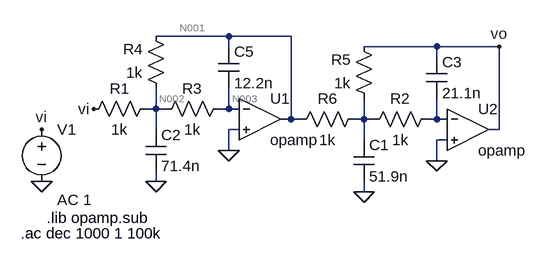
[diagram p0: schematic Draft1.asc]
Draft1.asc, the LTspice schematic file:
Version 4
SHEET 1 880 680
WIRE 80 0 -32 0
WIRE 176 0 80 0
WIRE 80 16 80 0
WIRE 400 16 288 16
WIRE 496 16 400 16
WIRE 400 32 400 16
WIRE -32 112 -32 80
WIRE -32 112 -48 112
WIRE -16 112 -32 112
WIRE 80 112 80 80
WIRE 80 112 64 112
WIRE 96 112 80 112
WIRE 176 128 176 0
WIRE 176 128 160 128
WIRE 192 128 176 128
WIRE 288 128 288 96
WIRE 288 128 272 128
WIRE 304 128 288 128
WIRE 400 128 400 96
WIRE 400 128 384 128
WIRE 416 128 400 128
WIRE -32 144 -32 112
WIRE 96 144 80 144
WIRE 496 144 496 16
WIRE 496 144 480 144
WIRE 288 160 288 128
WIRE 416 160 400 160
WIRE 80 176 80 144
WIRE 400 192 400 160
WIRE -32 224 -32 208
WIRE 288 240 288 224
FLAG -32 224 0
FLAG 80 176 0
FLAG -208 224 0
FLAG -208 144 vi
FLAG -128 112 vi
FLAG 288 240 0
FLAG 400 192 0
FLAG 496 16 vo
SYMBOL OpAmps\\opamp 128 64 R0
SYMATTR InstName U1
SYMATTR SpiceLine Aol=1000K
SYMBOL res -32 96 R90
WINDOW 0 0 56 VBottom 2
WINDOW 3 32 56 VTop 2
SYMATTR InstName R1
SYMATTR Value 1k
SYMBOL res 80 96 R90
WINDOW 0 0 56 VBottom 2
WINDOW 3 32 56 VTop 2
SYMATTR InstName R3
SYMATTR Value 1k
SYMBOL res -16 96 R180
WINDOW 0 36 76 Left 2
WINDOW 3 36 40 Left 2
SYMATTR InstName R4
SYMATTR Value 1k
SYMBOL cap -48 144 R0
SYMATTR InstName C2
SYMATTR Value 71.4n
SYMBOL cap 64 16 R0
SYMATTR InstName C5
SYMATTR Value 12.2n
SYMBOL voltage -208 128 R0
WINDOW 123 24 124 Left 2
WINDOW 39 0 0 Left 0
SYMATTR Value2 AC 1
SYMATTR InstName V1
SYMATTR Value ""
SYMBOL OpAmps\\opamp 448 80 R0
SYMATTR InstName U2
SYMATTR SpiceLine Aol=1000K
SYMBOL res 400 112 R90
WINDOW 0 0 56 VBottom 2
WINDOW 3 32 56 VTop 2
SYMATTR InstName R2
SYMATTR Value 1k
SYMBOL res 304 112 R180
WINDOW 0 36 76 Left 2
WINDOW 3 36 40 Left 2
SYMATTR InstName R5
SYMATTR Value 1k
SYMBOL cap 272 160 R0
SYMATTR InstName C1
SYMATTR Value 51.9n
SYMBOL cap 384 32 R0
SYMATTR InstName C3
SYMATTR Value 21.1n
SYMBOL res 288 112 R90
WINDOW 0 0 56 VBottom 2
WINDOW 3 32 56 VTop 2
SYMATTR InstName R6
SYMATTR Value 1k
TEXT -200 280 Left 2 !.lib opamp.sub
TEXT -240 304 Left 2 !.ac dec 1000 1 100k

The netlist it stands for:
* Draft1.asc
XU1 N003 0 N001 opamp Aol=1000K GBW=10Meg  ; pins invin noninvin out
R1 N002 vi 1k
R3 N003 N002 1k
R4 N002 N001 1k
C2 N002 0 71.4n
C5 N001 N003 12.2n
V1 vi 0 AC 1
XU2 N005 0 vo opamp Aol=1000K GBW=10Meg  ; pins invin noninvin out
R2 N005 N004 1k
R5 N004 vo 1k
C1 N004 0 51.9n
C3 vo N005 21.1n
R6 N004 N001 1k
.lib opamp.sub
.ac dec 1000 1 100k
.backanno
.end

* Results of the author's LTspice run, read from the files saved beside the schematic
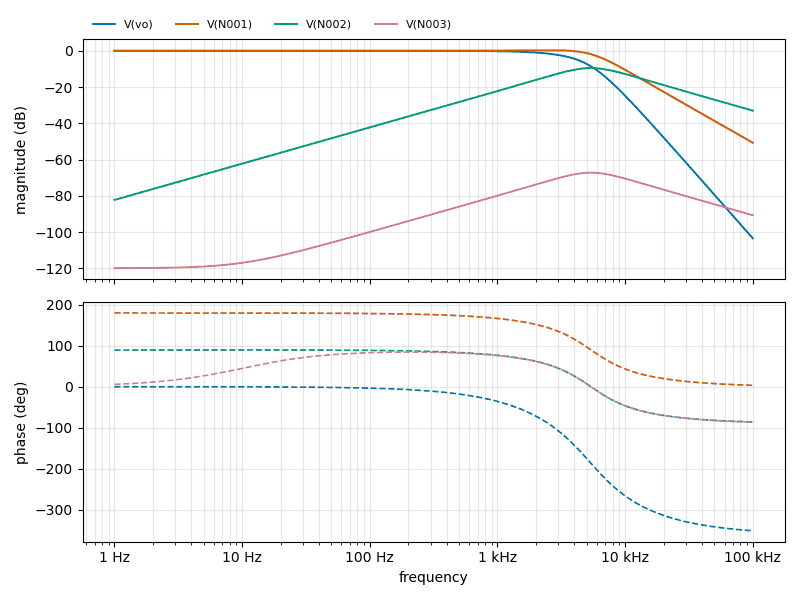
[diagram p1: AC Analysis of Draft1.asc, plotted from the saved traces]
* AC Analysis, 1 run:
*   V(vo): -0.00 dB at 1 Hz, -103.47 dB at 100 kHz, peak -0.00 dB at 1 Hz, 3 dB below the peak at 3.372 kHz
*   V(N001): -0.00 dB at 1 Hz, -50.73 dB at 100 kHz, peak 0.24 dB at 2.594 kHz, 3 dB below the peak at 5.914 kHz
*   V(N002): -82.30 dB at 1 Hz, -33.03 dB at 100 kHz, peak -9.53 dB at 5.395 kHz, 3 dB below the peak at 3 kHz and 9.681 kHz
*   V(N003): -119.94 dB at 1 Hz, -90.73 dB at 100 kHz, peak -67.24 dB at 5.395 kHz, 3 dB below the peak at 3 kHz and 9.681 kHz